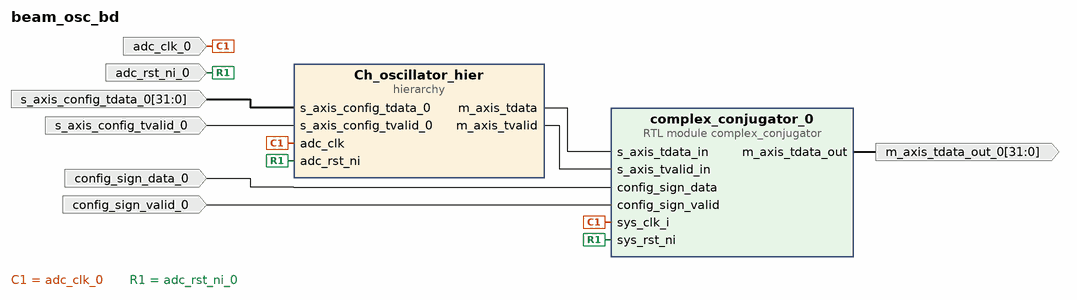
[diagram p0: block diagram of the top level]
# Vivado block design beam_osc_bd, xc7z030fbg676-2, Vivado 2024.2
create_bd_design beam_osc_bd

create_bd_port -dir I -type clk adc_clk_0
set_property -dict {CONFIG.FREQ_HZ 260000000} [get_bd_ports adc_clk_0]
create_bd_port -dir I adc_rst_ni_0
create_bd_port -dir I config_sign_data_0
create_bd_port -dir I config_sign_valid_0
create_bd_port -dir O -from 31 -to 0 m_axis_tdata_out_0
create_bd_port -dir I -from 31 -to 0 s_axis_config_tdata_0
create_bd_port -dir I s_axis_config_tvalid_0

create_bd_cell -type hier Ch_oscillator_hier
create_bd_cell -type module -reference complex_conjugator complex_conjugator_0
set_property -dict {CONFIG.DATA_WIDTH 32} [get_bd_cells complex_conjugator_0]

# ---- hierarchy /Ch_oscillator_hier ----
current_bd_instance /Ch_oscillator_hier
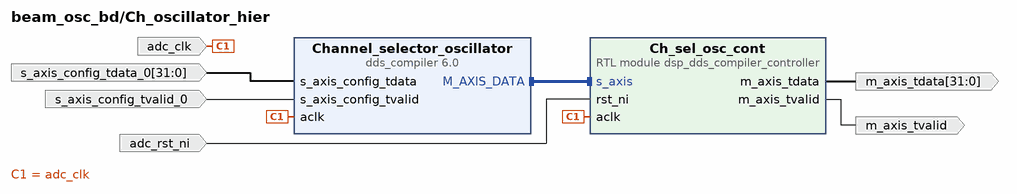
[diagram p1: block diagram inside /Ch_oscillator_hier]
create_bd_pin -dir I -type clk adc_clk
create_bd_pin -dir I adc_rst_ni
create_bd_pin -dir O -from 31 -to 0 m_axis_tdata
create_bd_pin -dir O m_axis_tvalid
create_bd_pin -dir I -from 31 -to 0 s_axis_config_tdata_0
create_bd_pin -dir I s_axis_config_tvalid_0

create_bd_cell -type module -reference dsp_dds_compiler_controller Ch_sel_osc_cont
set_property -dict {CONFIG.DATA_WIDTH 32 CONFIG.DIVIDE_CLK_FREQ_BY 32} [get_bd_cells Ch_sel_osc_cont]
create_bd_cell -type ip -vlnv xilinx.com:ip:dds_compiler:6.0 Channel_selector_oscillator
set_property -dict [list \
  CONFIG.DATA_Has_TLAST Not_Required \
  CONFIG.DDS_Clock_Rate 260 \
  CONFIG.Frequency_Resolution 0.4 \
  CONFIG.Has_ARESETn false \
  CONFIG.Has_Phase_Out false \
  CONFIG.Has_TREADY true \
  CONFIG.Latency 13 \
  CONFIG.M_DATA_Has_TUSER Not_Required \
  CONFIG.Noise_Shaping None \
  CONFIG.Output_Frequency1 0 \
  CONFIG.Output_Width 16 \
  CONFIG.PINC1 11111100000011111100000100000 \
  CONFIG.Parameter_Entry Hardware_Parameters \
  CONFIG.Phase_Increment Programmable \
  CONFIG.Phase_Width 32 \
  CONFIG.S_PHASE_Has_TUSER Not_Required \
] [get_bd_cells Channel_selector_oscillator]

# ---- connections ----

current_bd_instance /Ch_oscillator_hier
connect_bd_intf_net -intf_net Oscilador_local_M_AXIS_DATA_1 [get_bd_intf_pins Ch_sel_osc_cont/s_axis] [get_bd_intf_pins Channel_selector_oscillator/M_AXIS_DATA]
connect_bd_net [get_bd_pins Ch_sel_osc_cont/m_axis_tdata] [get_bd_pins m_axis_tdata]
connect_bd_net [get_bd_pins Ch_sel_osc_cont/m_axis_tvalid] [get_bd_pins m_axis_tvalid]
connect_bd_net -net aclk_0_1 [get_bd_pins adc_clk] [get_bd_pins Channel_selector_oscillator/aclk] [get_bd_pins Ch_sel_osc_cont/aclk]
connect_bd_net -net rst_ni_0_1 [get_bd_pins adc_rst_ni] [get_bd_pins Ch_sel_osc_cont/rst_ni]
connect_bd_net -net s_axis_config_tdata_0_1 [get_bd_pins s_axis_config_tdata_0] [get_bd_pins Channel_selector_oscillator/s_axis_config_tdata]
connect_bd_net -net s_axis_config_tvalid_0_1 [get_bd_pins s_axis_config_tvalid_0] [get_bd_pins Channel_selector_oscillator/s_axis_config_tvalid]

current_bd_instance /
connect_bd_net [get_bd_pins Ch_oscillator_hier/m_axis_tdata] [get_bd_pins complex_conjugator_0/s_axis_tdata_in]
connect_bd_net [get_bd_pins Ch_oscillator_hier/m_axis_tvalid] [get_bd_pins complex_conjugator_0/s_axis_tvalid_in]
connect_bd_net -net adc_clk_0_1 [get_bd_ports adc_clk_0] [get_bd_pins Ch_oscillator_hier/adc_clk] [get_bd_pins complex_conjugator_0/sys_clk_i]
connect_bd_net -net adc_rst_ni_0_1 [get_bd_ports adc_rst_ni_0] \
  [get_bd_pins Ch_oscillator_hier/adc_rst_ni] [get_bd_pins complex_conjugator_0/sys_rst_ni]
connect_bd_net [get_bd_pins complex_conjugator_0/m_axis_tdata_out] [get_bd_ports m_axis_tdata_out_0]
connect_bd_net -net config_sign_data_0_1 [get_bd_ports config_sign_data_0] [get_bd_pins complex_conjugator_0/config_sign_data]
connect_bd_net -net config_sign_valid_0_1 [get_bd_ports config_sign_valid_0] [get_bd_pins complex_conjugator_0/config_sign_valid]
connect_bd_net -net s_axis_config_tdata_0_1 [get_bd_ports s_axis_config_tdata_0] [get_bd_pins Ch_oscillator_hier/s_axis_config_tdata_0]
connect_bd_net -net s_axis_config_tvalid_0_1 [get_bd_ports s_axis_config_tvalid_0] [get_bd_pins Ch_oscillator_hier/s_axis_config_tvalid_0]

validate_bd_design
save_bd_design
